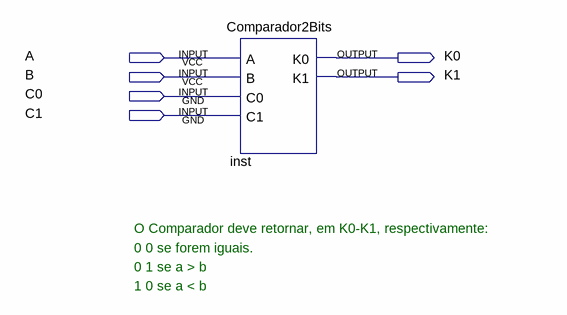
[diagram p0: schematic sheet]
// Quartus schematic 2bitsComparador.bdf as structural Verilog: 1 symbols, 6 pins
module \2bitsComparador  (
  input  A,
  input  B,
  input  C0,
  input  C1,
  output K0,
  output K1
);

  Comparador2Bits inst (.A(A), .B(B), .C0(C0), .C1(C1), .K0(K0), .K1(K1));

  // Notes on the sheet:
  //   O Comparador deve retornar, em K0-K1, respectivamente:
  //   0 0 se forem iguais.
  //   0 1 se a > b
  //   1 0 se a < b
endmodule
